# EAGLE design mini_digitboard (EAGLE 6.6.0)
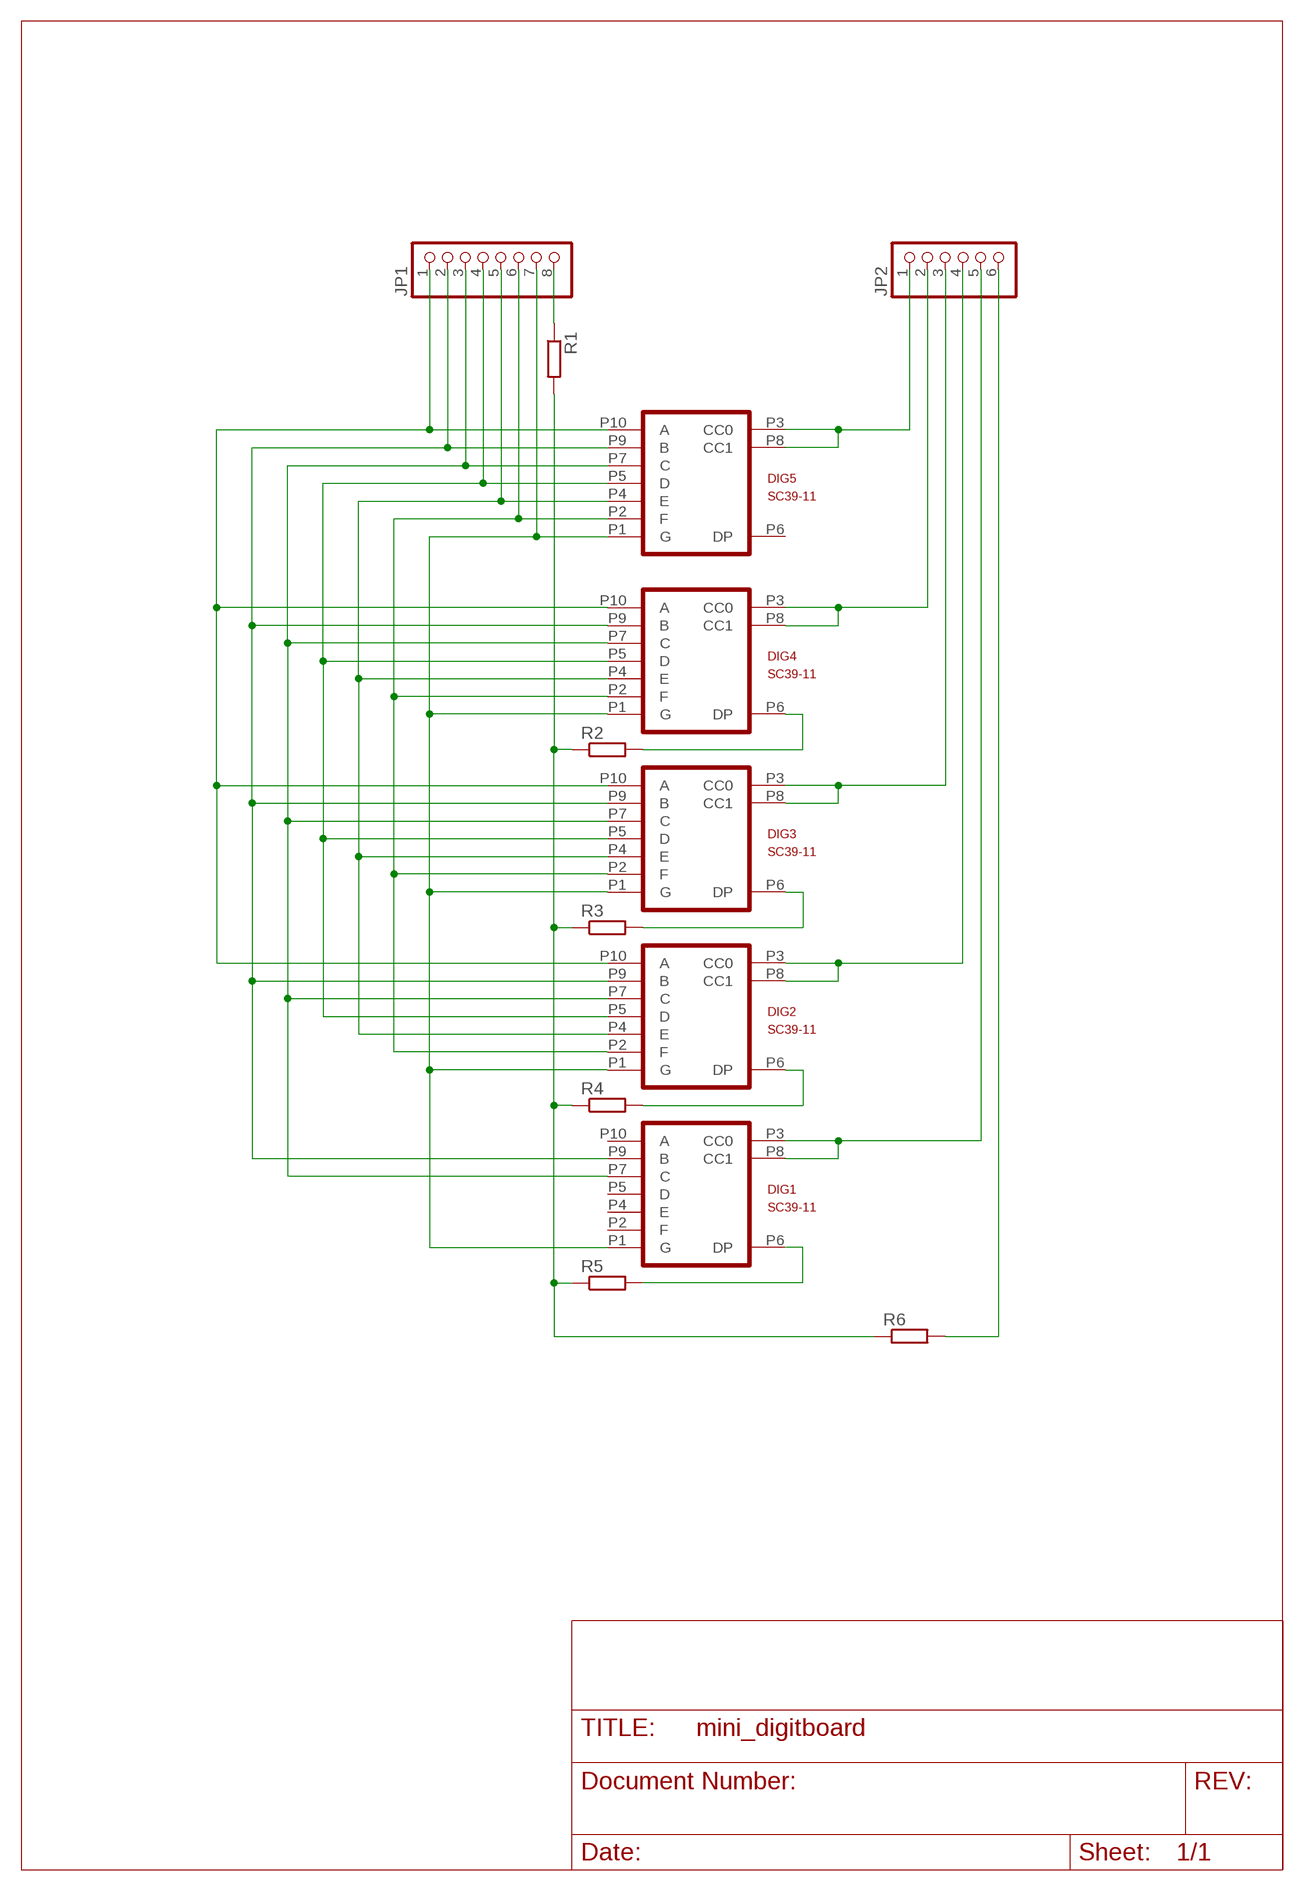
[diagram p0: schematic, sheet 1]

## Parts
DIG1  SC39-11  [SC39-11]
DIG2  SC39-11  [SC39-11]
DIG3  SC39-11  [SC39-11]
DIG4  SC39-11  [SC39-11]
DIG5  SC39-11  [SC39-11]
JP1  PINHD-1X8  [1X08]
JP2  PINHD-1X6  [1X06]
R1  R-EU_R0603  [R0603]
R2  R-EU_R0603  [R0603]
R3  R-EU_R0603  [R0603]
R4  R-EU_R0603  [R0603]
R5  R-EU_R0603  [R0603]
R6  R-EU_R0603  [R0603]

## Nets
N$1: JP2.6 R6.2
N$2: R1.2 R2.1 R3.1 R4.1 R5.1 R6.1
N$3: JP1.8 R1.1
N$5: DIG4.P6(DP) R2.2
N$6: DIG3.P6(DP) R3.2
N$7: DIG2.P6(DP) R4.2
N$8: DIG1.P6(DP) R5.2
N$10: DIG1.P1(G) DIG2.P1(G) DIG3.P1(G) DIG4.P1(G) DIG5.P1(G) JP1.7
N$42: DIG2.P10(A) DIG3.P10(A) DIG4.P10(A) DIG5.P10(A) JP1.1
N$43: DIG1.P9(B) DIG2.P9(B) DIG3.P9(B) DIG4.P9(B) DIG5.P9(B) JP1.2
N$44: DIG1.P7(C) DIG2.P7(C) DIG3.P7(C) DIG4.P7(C) DIG5.P7(C) JP1.3
N$45: DIG2.P5(D) DIG3.P5(D) DIG4.P5(D) DIG5.P5(D) JP1.4
N$46: DIG2.P4(E) DIG3.P4(E) DIG4.P4(E) DIG5.P4(E) JP1.5
N$47: DIG2.P2(F) DIG3.P2(F) DIG4.P2(F) DIG5.P2(F) JP1.6
N$50: DIG5.P3(CC0) DIG5.P8(CC1) JP2.1
N$51: DIG4.P3(CC0) DIG4.P8(CC1) JP2.2
N$52: DIG3.P3(CC0) DIG3.P8(CC1) JP2.3
N$53: DIG2.P3(CC0) DIG2.P8(CC1) JP2.4
N$54: DIG1.P3(CC0) DIG1.P8(CC1) JP2.5
Unconnected: DIG1.P2(F) DIG1.P4(E) DIG1.P5(D) DIG1.P10(A) DIG5.P6(DP)

## Library data of the parts
DIG1-DIG5 = LEDVoltmeter:SC39-11
JP1 = pinhead:PINHD-1X8: PIN HEADER
JP2 = pinhead:PINHD-1X6: PIN HEADER
R1-R6 = rcl:R-EU_: RESISTOR, European symbol

## Board
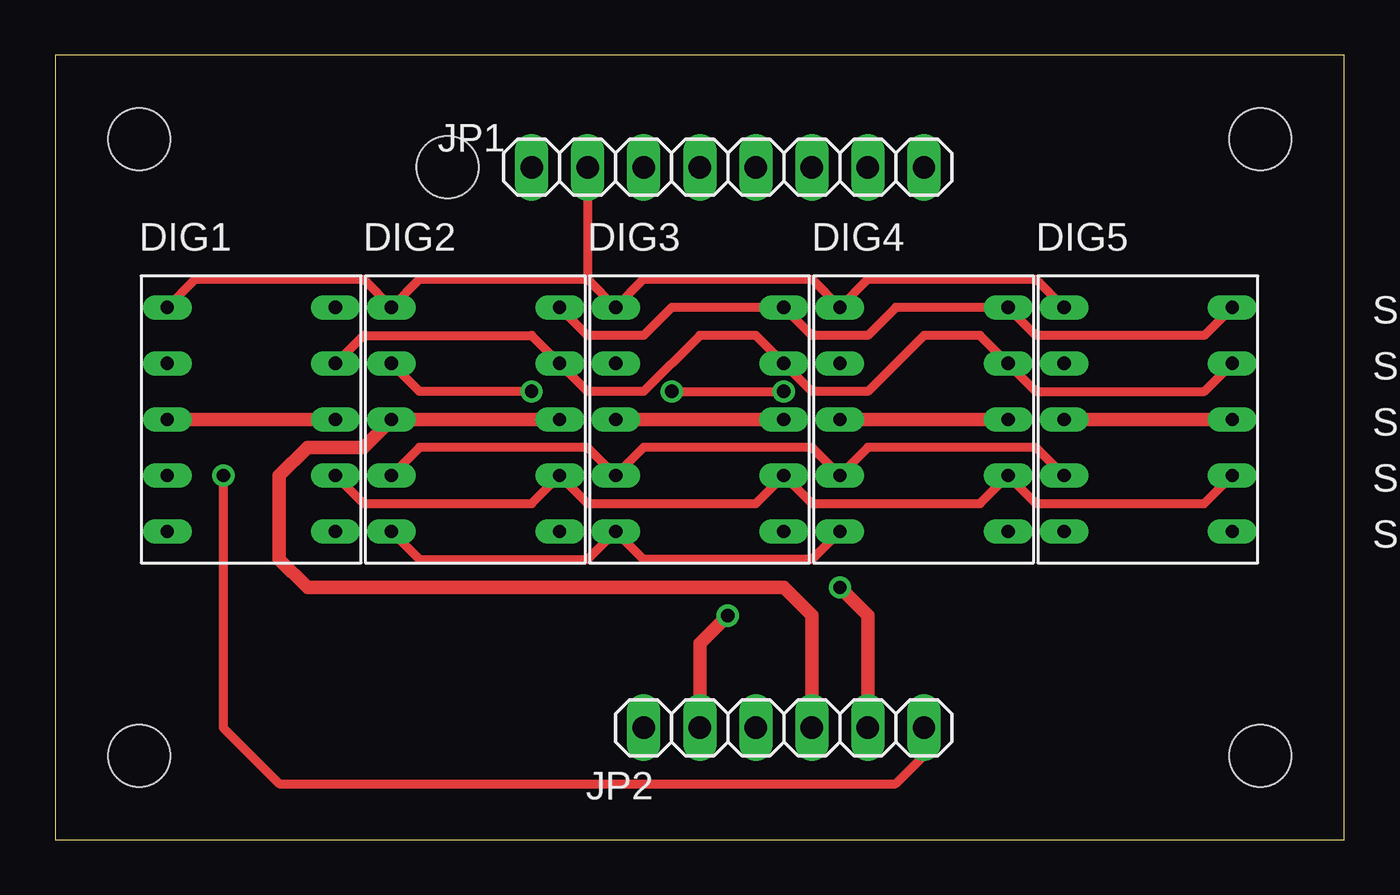
[diagram p1: board, top side]
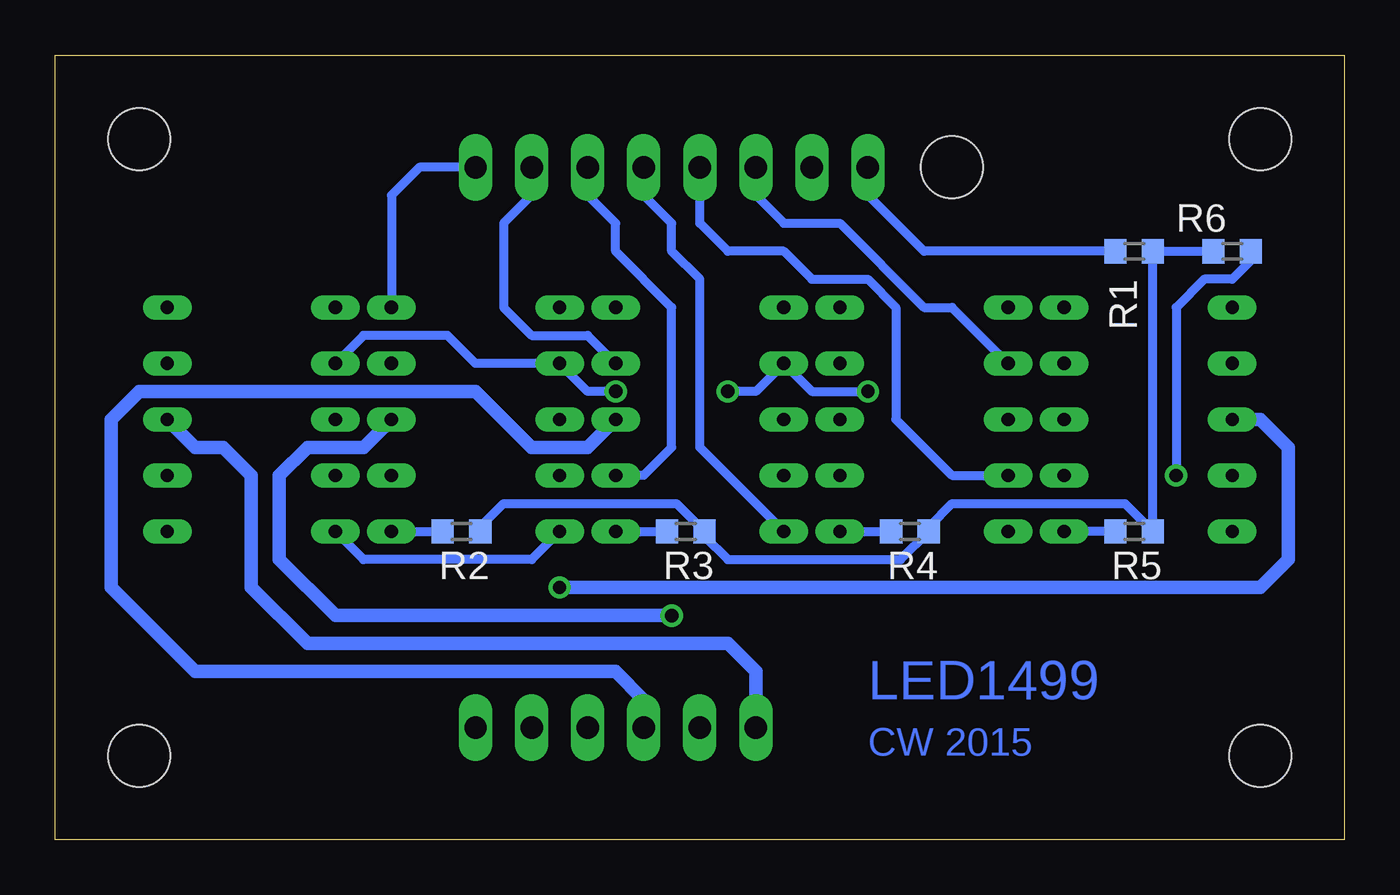
[diagram p2: board, bottom side, seen from below]

Size 58.42 x 35.56 mm. Coordinates in mm from the lower left corner, seen from the top.
Outline: 0,0 58.42,0 58.42,35.56 0,35.56 0,0
Copper layers (1*16): Top 0.035mm / dielectric 1.5mm / Bottom 0.035mm
Design rules "eigene_max1499": minimum track width 10mil, minimum drill 23mil, track to track 6mil, track to pad 6mil, pad to pad 6mil, via to via 6mil, smd to smd 6mil, copper to edge 40mil, drill to drill 8mil, minimum pad ring 10mil, minimum via ring 8mil, stop-mask expansion 4mil, vias tented up to drill 0mil, thermal gap 10mil
Holes 2.8 mm at 17.78,30.48 3.81,31.75 54.61,31.75 54.61,3.81 3.81,3.81

### Footprints (pad centres in the part's own frame; a part is rotated, then mirrored left to right if it is on the bottom)
SC39-11 = drill 0.6 long: P1 -3.81,5.08; P2 -3.81,2.54; P3 -3.81,0; P4 -3.81,-2.54; P5 -3.81,-5.08; P6 3.81,-5.08; P7 3.81,-2.54; P8 3.81,0; P9 3.81,2.54; P10 3.81,5.08
1X08 = drill 1.016 long: 1 -8.89,0; 2 -6.35,0; 3 -3.81,0; 4 -1.27,0; 5 1.27,0; 6 3.81,0; 7 6.35,0; 8 8.89,0
1X06 = drill 1.016 long: 1 -6.35,0; 2 -3.81,0; 3 -1.27,0; 4 1.27,0; 5 3.81,0; 6 6.35,0
R0603 = smd 1 x 1.1: 1 -0.85,0; 2 0.85,0

### Placement (x,y rotation side)
DIG1  8.89,19.05 0 top
DIG2  19.05,19.05 0 top
DIG3  29.21,19.05 0 top
DIG4  39.37,19.05 0 top
DIG5  49.53,19.05 0 top
JP1  30.48,30.48 180 top
JP2  33.02,5.08 0 top
R1  9.53,26.67 0 bottom
R2  40.01,13.97 180 bottom
R3  29.84,13.97 180 bottom
R4  19.68,13.97 180 bottom
R5  9.53,13.97 180 bottom
R6  5.08,26.67 0 bottom

### Tracks (layer width: path | path; a pad name or v marks a point on that pad's centre or on a via)
N$1  (via drill 0.6)
  Top 0.406: v7.62,16.51 7.62,5.08 10.16,2.54 38.1,2.54 39.37,3.81 JP2.6
  Bottom 0.406: R6.2 4.23,26.25 5.08,25.4 6.35,25.4 7.62,24.13 v7.62,16.51
N$2
  Bottom 0.406: R2.1 39.16,14.19 38.1,15.24 30.27,15.24 R3.1 29,13.76 27.94,12.7 20.11,12.7 R4.1 18.84,14.19 17.78,15.24 9.95,15.24 R5.1 R1.2 R6.1
N$3
  Bottom 0.406: R1.1 19.05,26.67 21.59,29.21 JP1.8
N$5
  Bottom 0.406: DIG4.P6 R2.2
N$6
  Bottom 0.406: DIG3.P6 R3.2
N$7
  Bottom 0.406: DIG2.P6 R4.2
N$8
  Bottom 0.406: R5.2 DIG1.P6
N$10
  Top 0.406: DIG1.P1 6.35,25.4 13.97,25.4 DIG2.P1 16.51,25.4 24.13,25.4 | 24.13,25.4 DIG3.P1 26.67,25.4 34.29,25.4 DIG4.P1 36.83,25.4 44.45,25.4 DIG5.P1 | JP1.7 24.13,25.4
N$42
  Top 0.406: DIG5.P10 52.07,22.86 44.45,22.86 DIG4.P10 38.1,24.13 36.83,22.86 34.29,22.86 DIG3.P10 27.94,24.13 26.67,22.86 24.13,22.86 DIG2.P10
  Bottom 0.406: JP1.1 41.91,30.48 43.18,29.21 DIG4.P10
N$43
  Top 0.406: DIG1.P9 13.97,22.86 21.59,22.86 DIG2.P9 24.13,20.32 26.67,20.32 29.21,22.86 31.75,22.86 DIG3.P9 34.29,20.32 36.83,20.32 39.37,22.86 41.91,22.86 DIG4.P9 44.45,20.32 52.07,20.32 DIG5.P9
  Bottom 0.406: JP1.2 36.83,29.21 38.1,27.94 38.1,24.13 36.83,22.86 34.29,22.86 DIG3.P9
N$44
  Top 0.406: DIG1.P7 13.97,15.24 21.59,15.24 DIG2.P7 24.13,15.24 31.75,15.24 DIG3.P7 34.29,15.24 41.91,15.24 DIG4.P7 44.45,15.24 52.07,15.24 DIG5.P7
  Bottom 0.406: DIG3.P7 31.75,16.51 30.48,17.78 30.48,24.13 33.02,26.67 33.02,27.94 34.29,29.21 JP1.3
N$45
  Top 0.406: DIG2.P5 16.51,12.7 24.13,12.7 DIG3.P5 26.67,12.7 34.29,12.7 DIG4.P5
  Bottom 0.406: DIG3.P5 29.21,17.78 29.21,25.4 30.48,26.67 30.48,27.94 31.75,29.21 JP1.4 | DIG4.P5 36.83,12.7 44.45,12.7 DIG5.P5
N$46
  Top 0.406: DIG2.P4 16.51,17.78 24.13,17.78 DIG3.P4 26.67,17.78 34.29,17.78 DIG4.P4 36.83,17.78 44.45,17.78 DIG5.P4
  Bottom 0.406: DIG2.P4 17.78,16.51 20.32,19.05 20.32,24.13 21.59,25.4 24.13,25.4 25.4,26.67 27.94,26.67 29.21,27.94 JP1.5
N$47  (via drill 0.6)
  Top 0.406: v27.94,20.32 v33.02,20.32 | v21.59,20.32 16.51,20.32 DIG2.P2
  Bottom 0.406: v27.94,20.32 26.67,20.32 DIG3.P2 24.13,20.32 v21.59,20.32 | v33.02,20.32 34.29,20.32 DIG4.P2 39.37,21.59 40.64,22.86 44.45,22.86 DIG5.P2 | JP1.6 26.67,29.21 25.4,27.94 22.86,27.94 19.05,24.13 17.78,24.13 DIG2.P2
N$50
  Top 0.61: DIG5.P8 DIG5.P3
  Bottom 0.61: DIG5.P8 52.07,17.78 50.8,17.78 49.53,16.51 49.53,11.43 46.99,8.89 27.94,8.89 26.67,7.62 JP2.1
N$51  (via drill 0.6)
  Top 0.61: DIG4.P3 DIG4.P8 | JP2.2 29.21,8.89 v30.48,10.16
  Bottom 0.61: DIG4.P8 44.45,17.78 46.99,17.78 48.26,16.51 48.26,12.7 45.72,10.16 v30.48,10.16
N$52
  Top 0.61: DIG3.P3 DIG3.P8
  Bottom 0.61: DIG3.P8 34.29,17.78 36.83,17.78 39.37,20.32 54.61,20.32 55.88,19.05 55.88,11.43 52.07,7.62 33.02,7.62 31.75,6.35 JP2.3
N$53
  Top 0.61: DIG2.P8 DIG2.P3 13.97,17.78 11.43,17.78 10.16,16.51 10.16,12.7 11.43,11.43 33.02,11.43 34.29,10.16 JP2.4
N$54  (via drill 0.6)
  Top 0.61: DIG1.P3 DIG1.P8 | JP2.5 36.83,10.16 v35.56,11.43
  Bottom 0.61: v35.56,11.43 3.81,11.43 2.54,12.7 2.54,17.78 3.81,19.05 DIG1.P3

### Text on the board
Bottom: LED1499 | CW 2015